# EAGLE design ADC (EAGLE 9.3.1)
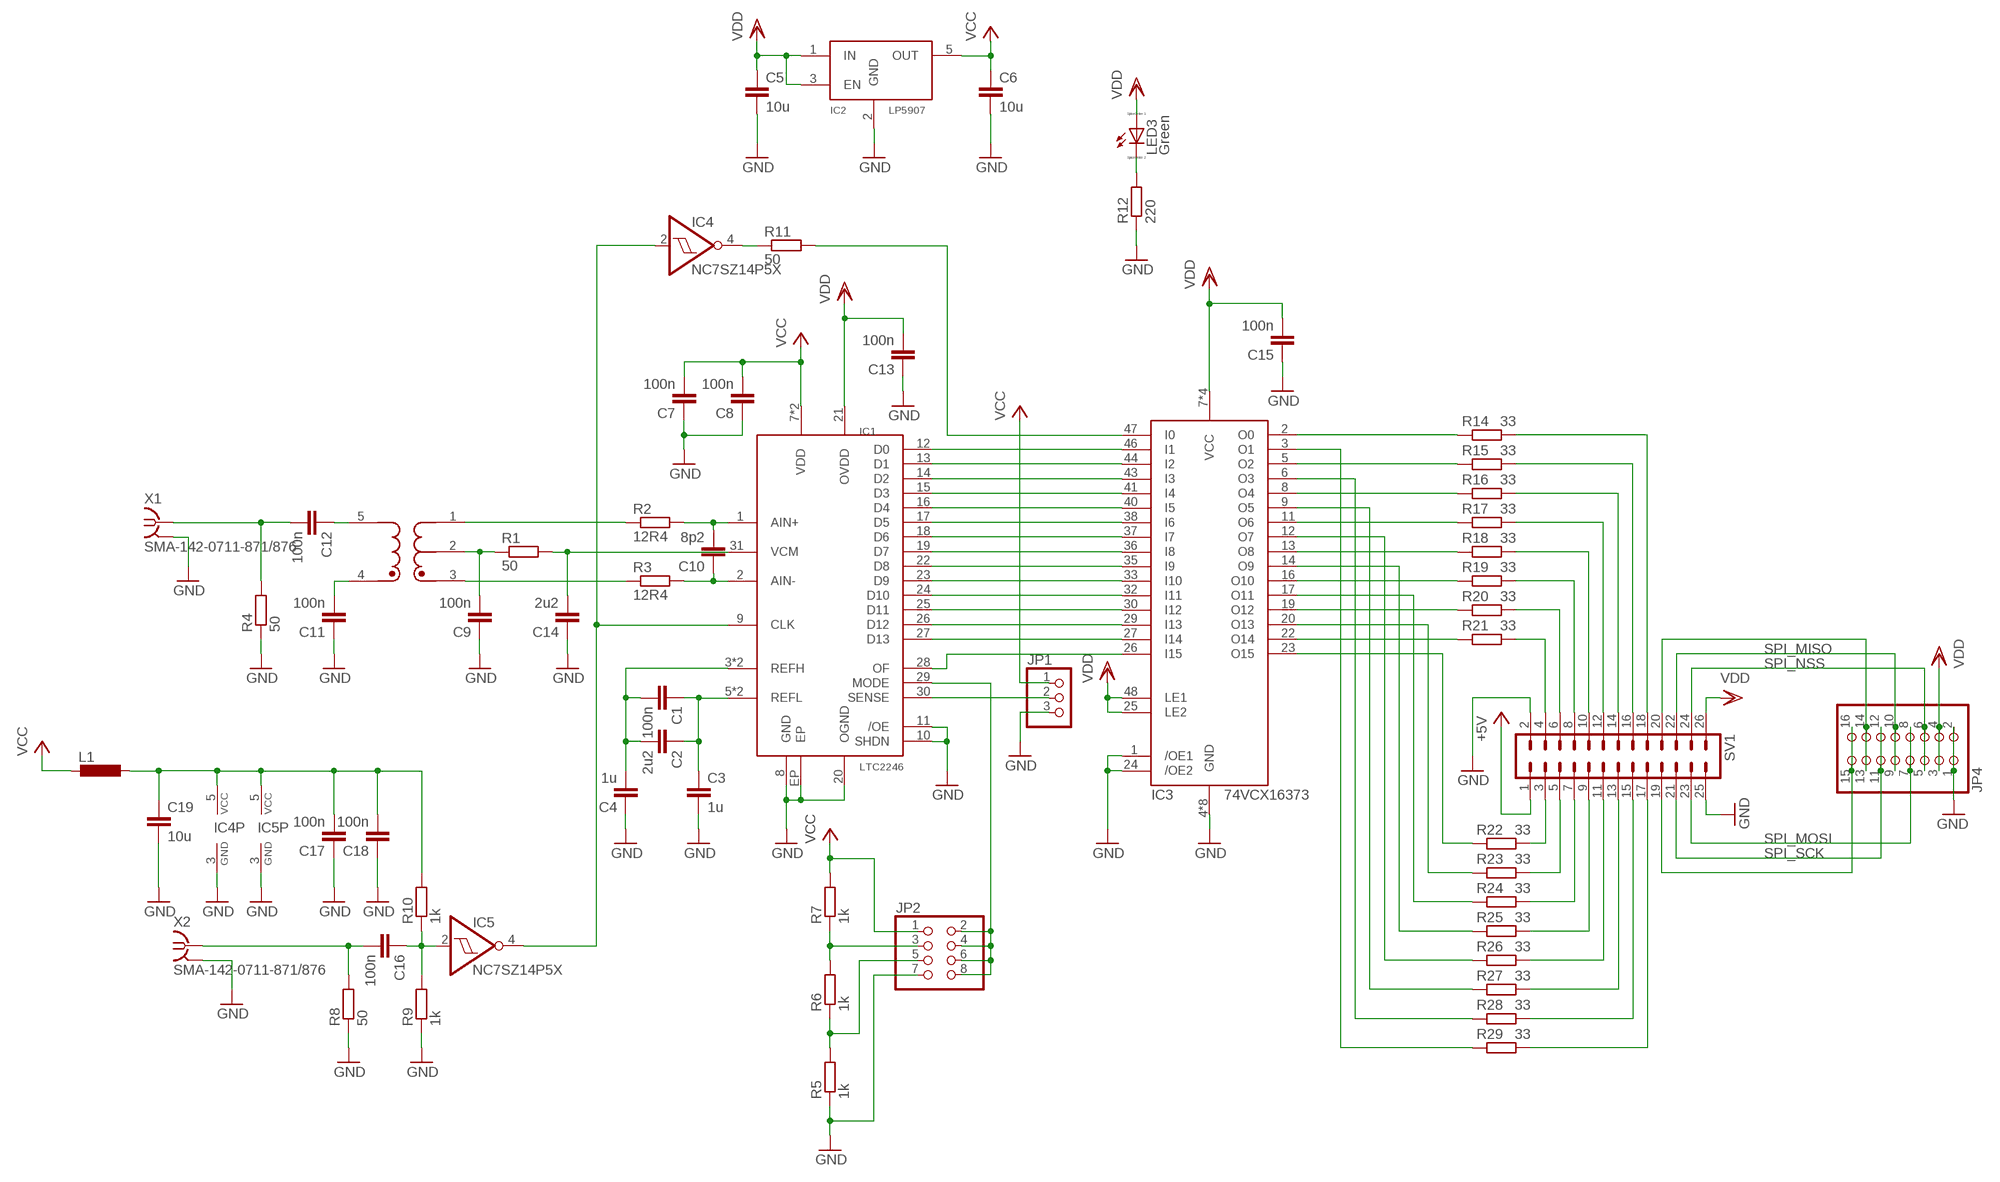
[diagram p0: schematic, sheet 1]

## Parts
B1  ETC1-1T  [SM-22]
C1  100n  C-EUC0402K  [C0402K]
C2  2u2  C-EUC0603K  [C0603K]
C3  1u  C-EUC0603K  [C0603K]
C4  1u  C-EUC0603K  [C0603K]
C5  10u  C-EUC1206K  [C1206K]
C6  10u  C-EUC1206K  [C1206K]
C7  100n  C-EUC0603K  [C0603K]
C8  100n  C-EUC0603K  [C0603K]
C9  100n  C-EUC0603K  [C0603K]
C10  8p2  C-EUC0603K  [C0603K]
C11  100n  C-EUC0603K  [C0603K]
C12  100n  C-EUC0603K  [C0603K]
C13  100n  C-EUC0402K  [C0402K]
C14  2u2  C-EUC0603K  [C0603K]
C15  100n  C-EUC0603K  [C0603K]
C16  100n  C-EUC0603K  [C0603K]
C17  100n  C-EUC0603K  [C0603K]
C18  100n  C-EUC0603K  [C0603K]
C19  10u  C-EUC1206K  [C1206K]
IC1  LTC2246  [TQFP32-EP]
IC2  LP5907  [SOT23-5L]
IC3  74VCX16373  [SOP50P810X120-48]
IC4  NC7SZ14P5X  [SC70-5]
IC5  NC7SZ14P5X  [SC70-5]
JP1  PINHD-1X3  [1X03]
JP2  PINHD-2X4  [2X04]
JP4  PINHD-2X8/90  [2X08/90]
L1  L-EUL2012C  [L2012C]
LED3  Green  LED_ESML0603  [LED_SML0603]
R1  50  R-EU_R0603  [R0603]
R2  12R4  R-EU_R0603  [R0603]
R3  12R4  R-EU_R0603  [R0603]
R4  50  R-EU_R0603  [R0603]
R5  1k  R-EU_R0603  [R0603]
R6  1k  R-EU_R0603  [R0603]
R7  1k  R-EU_R0603  [R0603]
R8  50  R-EU_R0603  [R0603]
R9  1k  R-EU_R0603  [R0603]
R10  1k  R-EU_R0603  [R0603]
R11  50  R-EU_R0603  [R0603]
R12  220  R-EU_R0603  [R0603]
R14  33  R-EU_R0603  [R0603]
R15  33  R-EU_R0603  [R0603]
R16  33  R-EU_R0603  [R0603]
R17  33  R-EU_R0603  [R0603]
R18  33  R-EU_R0603  [R0603]
R19  33  R-EU_R0603  [R0603]
R20  33  R-EU_R0603  [R0603]
R21  33  R-EU_R0603  [R0603]
R22  33  R-EU_R0603  [R0603]
R23  33  R-EU_R0603  [R0603]
R24  33  R-EU_R0603  [R0603]
R25  33  R-EU_R0603  [R0603]
R26  33  R-EU_R0603  [R0603]
R27  33  R-EU_R0603  [R0603]
R28  33  R-EU_R0603  [R0603]
R29  33  R-EU_R0603  [R0603]
SV1  ML26L  [ML26L]
X1  SMA-142-0711-871/876  [J502-ND-142-0711-871/876]
X2  SMA-142-0711-871/876  [J502-ND-142-0711-871/876]

## Nets
+5V: SV1.1
GND: C3.2 C4.1 C5.2 C6.2 C7.1 C8.1 C9.1 C11.1 C13.1 C14.1 C15.1 C17.1 C18.1 C19.2 IC1.8(GND) IC1.10(SHDN) IC1.11(/OE) IC1.20(OGND) IC1.EP IC2.2(GND) IC3.1(/OE1) IC3.4(GND) IC3.10(GND) IC3.15(GND) IC3.21(GND) IC3.24(/OE2) IC3.28(GND) IC3.34(GND) IC3.39(GND) IC3.45(GND) IC4.3(GND) IC5.3(GND) JP1.3 JP2.7 JP4.1 JP4.2 R4.1 R5.1 R8.1 R9.1 R12.1 SV1.2 SV1.25 X1.G@1 X1.G@2 X1.G@3 X1.G@4 X2.G@1 X2.G@2 X2.G@3 X2.G@4
N$1: C1.1 C2.1 C3.1 IC1.5(REFL) IC1.6(REFL)
N$2: C1.2 C2.2 C4.2 IC1.3(REFH) IC1.4(REFH)
N$3: B1.2(SEC_CT) C9.2 R1.1
N$4: C14.2 IC1.31(VCM) R1.2
N$5: C10.2 IC1.1(AIN+) R2.2
N$6: B1.5(PRI) C12.1
N$7: C10.1 IC1.2(AIN-) R3.2
N$8: B1.3(SEC_DOT) R3.1
N$9: B1.4(PRI_DOT) C11.2
N$10: B1.1(SEC) R2.1
N$11: C12.2 R4.2 X1.1
N$12: IC1.12(D0) IC3.46(I1)
N$13: IC1.13(D1) IC3.44(I2)
N$14: IC1.14(D2) IC3.43(I3)
N$15: IC1.15(D3) IC3.41(I4)
N$16: IC1.16(D4) IC3.40(I5)
N$17: IC1.17(D5) IC3.38(I6)
N$18: IC1.18(D6) IC3.37(I7)
N$19: IC1.19(D7) IC3.36(I8)
N$20: IC1.22(D8) IC3.35(I9)
N$21: IC1.23(D9) IC3.33(I10)
N$22: IC1.24(D10) IC3.32(I11)
N$23: IC1.25(D11) IC3.30(I12)
N$24: IC1.26(D12) IC3.29(I13)
N$25: IC1.27(D13) IC3.27(I14)
N$26: IC1.28(OF) IC3.26(I15)
N$27: R18.2 SV1.10
N$28: IC3.23(O15) R22.1
N$29: IC3.22(O14) R21.1
N$30: IC3.20(O13) R23.1
N$31: IC3.19(O12) R20.1
N$32: IC3.17(O11) R24.1
N$33: R19.2 SV1.8
N$34: IC3.14(O9) R25.1
N$35: IC3.12(O7) R26.1
N$36: R17.2 SV1.12
N$37: IC3.9(O5) R27.1
N$38: R16.2 SV1.14
N$39: IC3.6(O3) R28.1
N$40: R15.2 SV1.16
N$41: IC3.3(O1) R29.1
N$42: R14.2 SV1.18
N$43: IC1.30(SENSE) JP1.2
N$44: JP2.5 R5.2 R6.1
N$45: JP2.3 R6.2 R7.1
N$46: IC1.29(MODE) JP2.2 JP2.4 JP2.6 JP2.8
N$47: C16.1 IC5.2(I) R9.2 R10.1
N$48: C16.2 R8.2 X2.1
N$49: IC1.9(CLK) IC4.2(I) IC5.4(O)
N$50: IC4.4(O) R11.1
N$51: IC3.47(I0) R11.2
N$52: LED3.C R12.2
N$53: IC3.2(O0) R14.1
N$54: IC3.5(O2) R15.1
N$55: IC3.8(O4) R16.1
N$56: IC3.11(O6) R17.1
N$57: IC3.13(O8) R18.1
N$58: IC3.16(O10) R19.1
N$59: R20.2 SV1.6
N$60: R21.2 SV1.4
N$61: R22.2 SV1.3
N$62: R23.2 SV1.5
N$63: R24.2 SV1.7
N$64: R25.2 SV1.9
N$65: R26.2 SV1.11
N$66: R27.2 SV1.13
N$67: R28.2 SV1.15
N$68: R29.2 SV1.17
N$73: JP4.13 JP4.14 SV1.20
N$74: JP4.15 JP4.16 SV1.19
SPI_MISO: JP4.9 JP4.10 SV1.22
SPI_MOSI: JP4.7 JP4.8 SV1.23
SPI_NSS: JP4.5 JP4.6 SV1.24
SPI_SCK: JP4.11 JP4.12 SV1.21
VCC: C6.1 C7.2 C8.2 IC1.7(VDD) IC1.32(VDD) IC2.5(OUT) JP1.1 JP2.1 L1.2 R7.2
VCC1: C17.2 C18.2 C19.1 IC4.5(VCC) IC5.5(VCC) L1.1 R10.2
VDD: C5.1 C13.2 C15.2 IC1.21(OVDD) IC2.1(IN) IC2.3(EN) IC3.7(VCC) IC3.18(VCC) IC3.25(LE2) IC3.31(VCC) IC3.42(VCC) IC3.48(LE1) JP4.3 JP4.4 LED3.A SV1.26

## Library data of the parts
B1 = transformers:ETC1-1T
C1-C4 C7-C18 = rcl:C-EU: CAPACITOR, European symbol; SPICEPREFIX: C
C5 C6 C19 = resistor:C-EU: CAPACITOR, European symbol
IC1 = custom-ic:LTC2246
IC2 = custom-ic:LP5907
IC3 = custom-ic:74VCX16373
IC4 IC5 = 74xx-little-de:NC7SZ14: TinyLogic(R) UHS Inverter with Schmitt Trigger Input Source: http://www.fairchildsemi.com/ds/NC/NC7SZ14.pdf
JP1 = pinhead:PINHD-1X3: PIN HEADER
JP2 = pinhead:PINHD-2X4: PIN HEADER
JP4 = pinhead:PINHD-2X8: PIN HEADER
L1 = rcl:L-EU: INDUCTOR, European symbol
LED3 = eagle-ltspice:LED_E: LED Source: http://www.osram.convergy.de Source: www.luxeon.com Source: www.kingbright.com; SPICEMODEL: NONE; SPICEPREFIX: D; SPICETYPE: diode
R1-R12 R14-R29 = resistor:R-EU_: RESISTOR, European symbol
SV1 = con-ml:ML26L: HARTING; OC_FARNELL: unknown; OC_NEWARK: unknown
X1 X2 = con-coax:SMA-: SMA 50 Ohm End Launch Jack Receptacle - Round Contact Johnson Components Source: www.johnsoncomponents.com .. J502-ND.pdf; MF: JOHNSON COMPONENTS; MPN: 142-0711-871; OC_FARNELL: unknown; OC_NEWARK: 01C1639

## Board
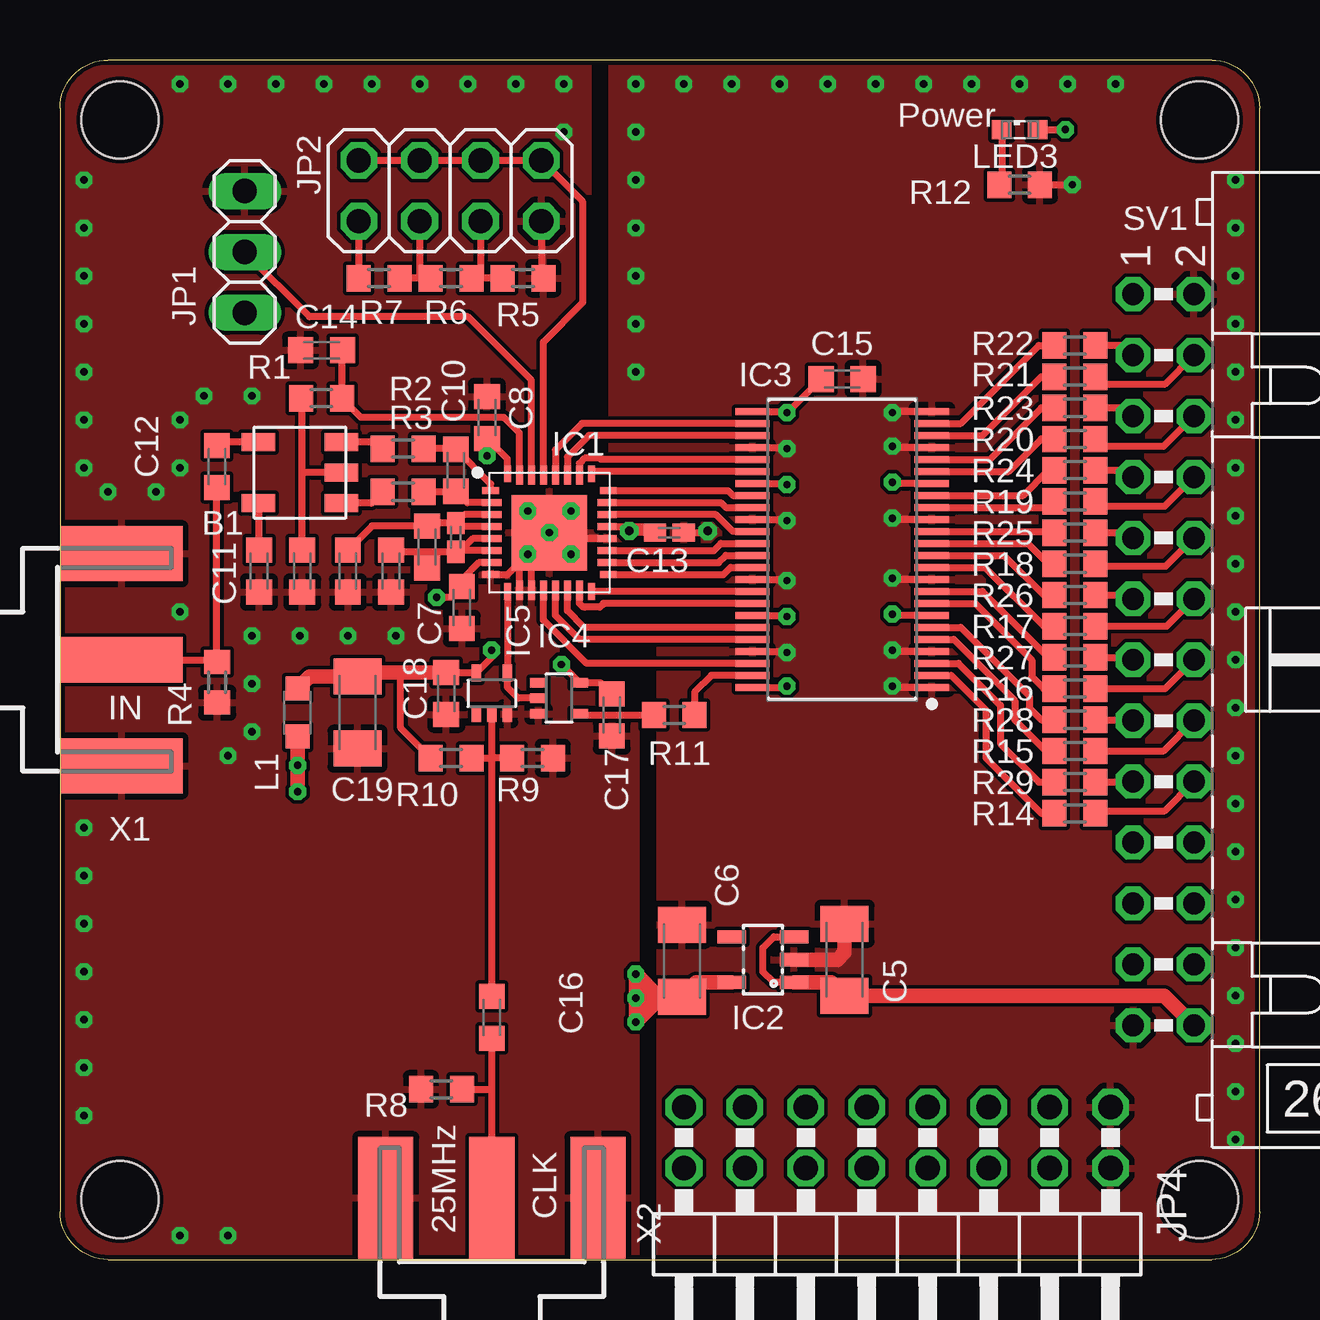
[diagram p1: board, top side]
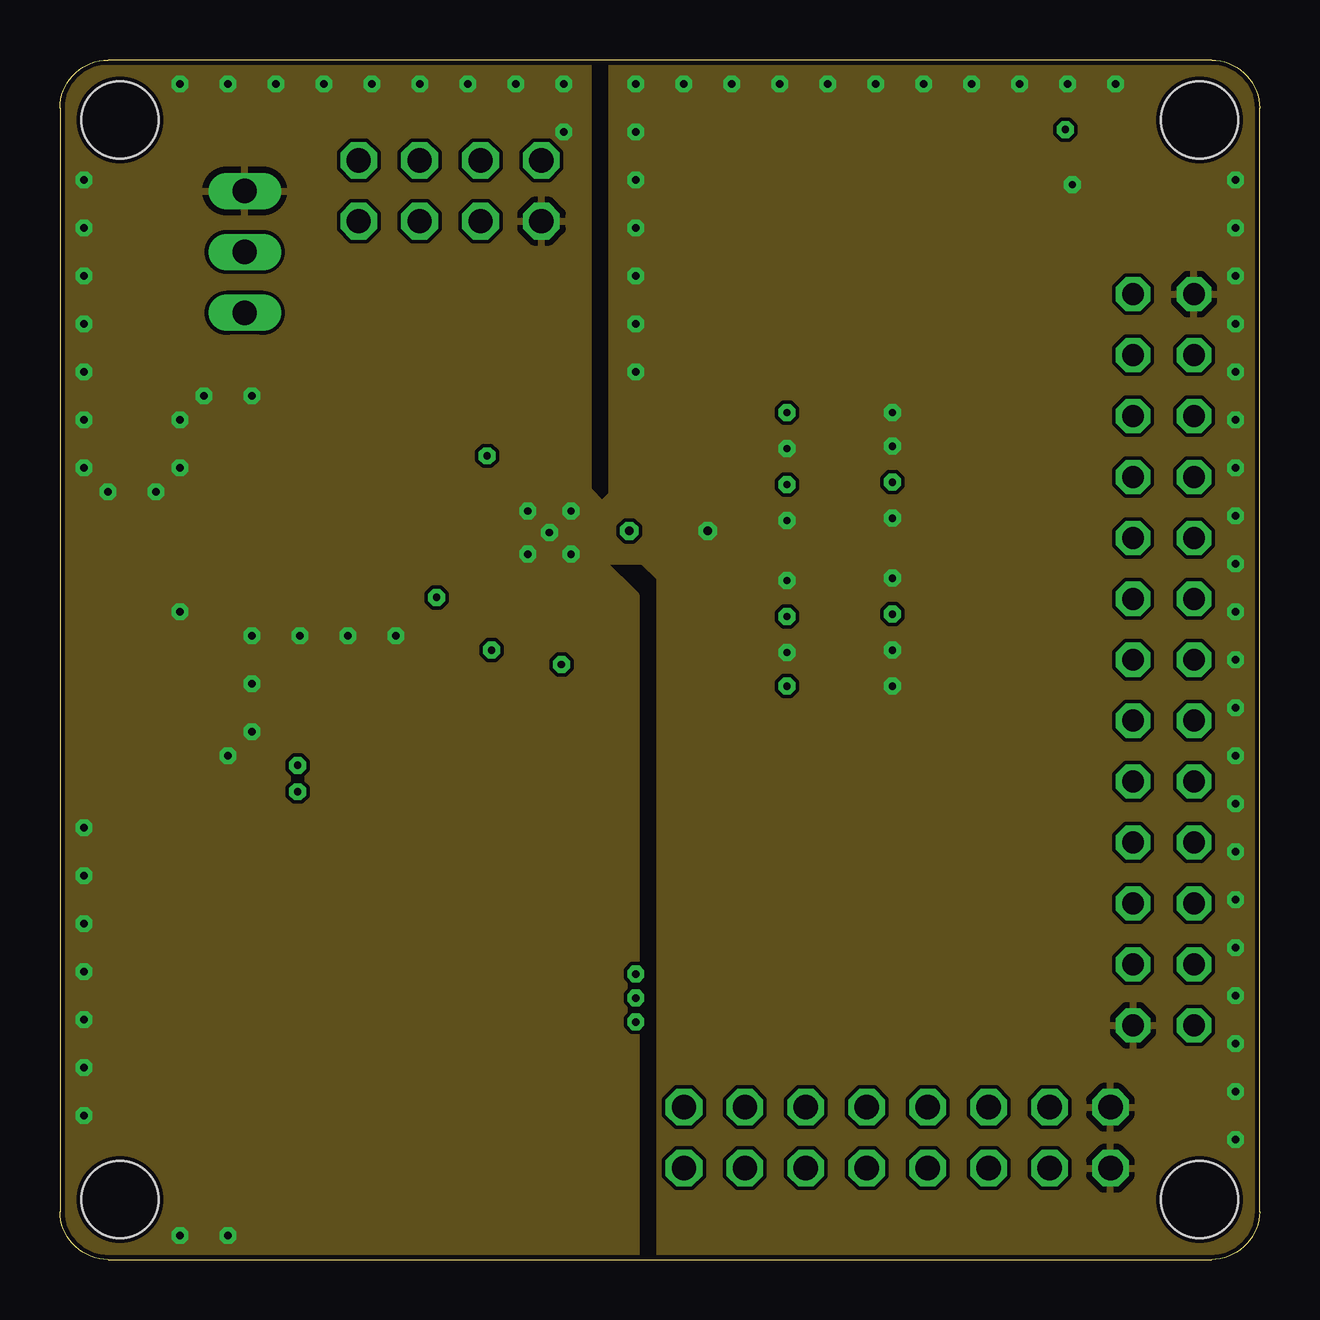
[diagram p2: board, inner layer Route2]
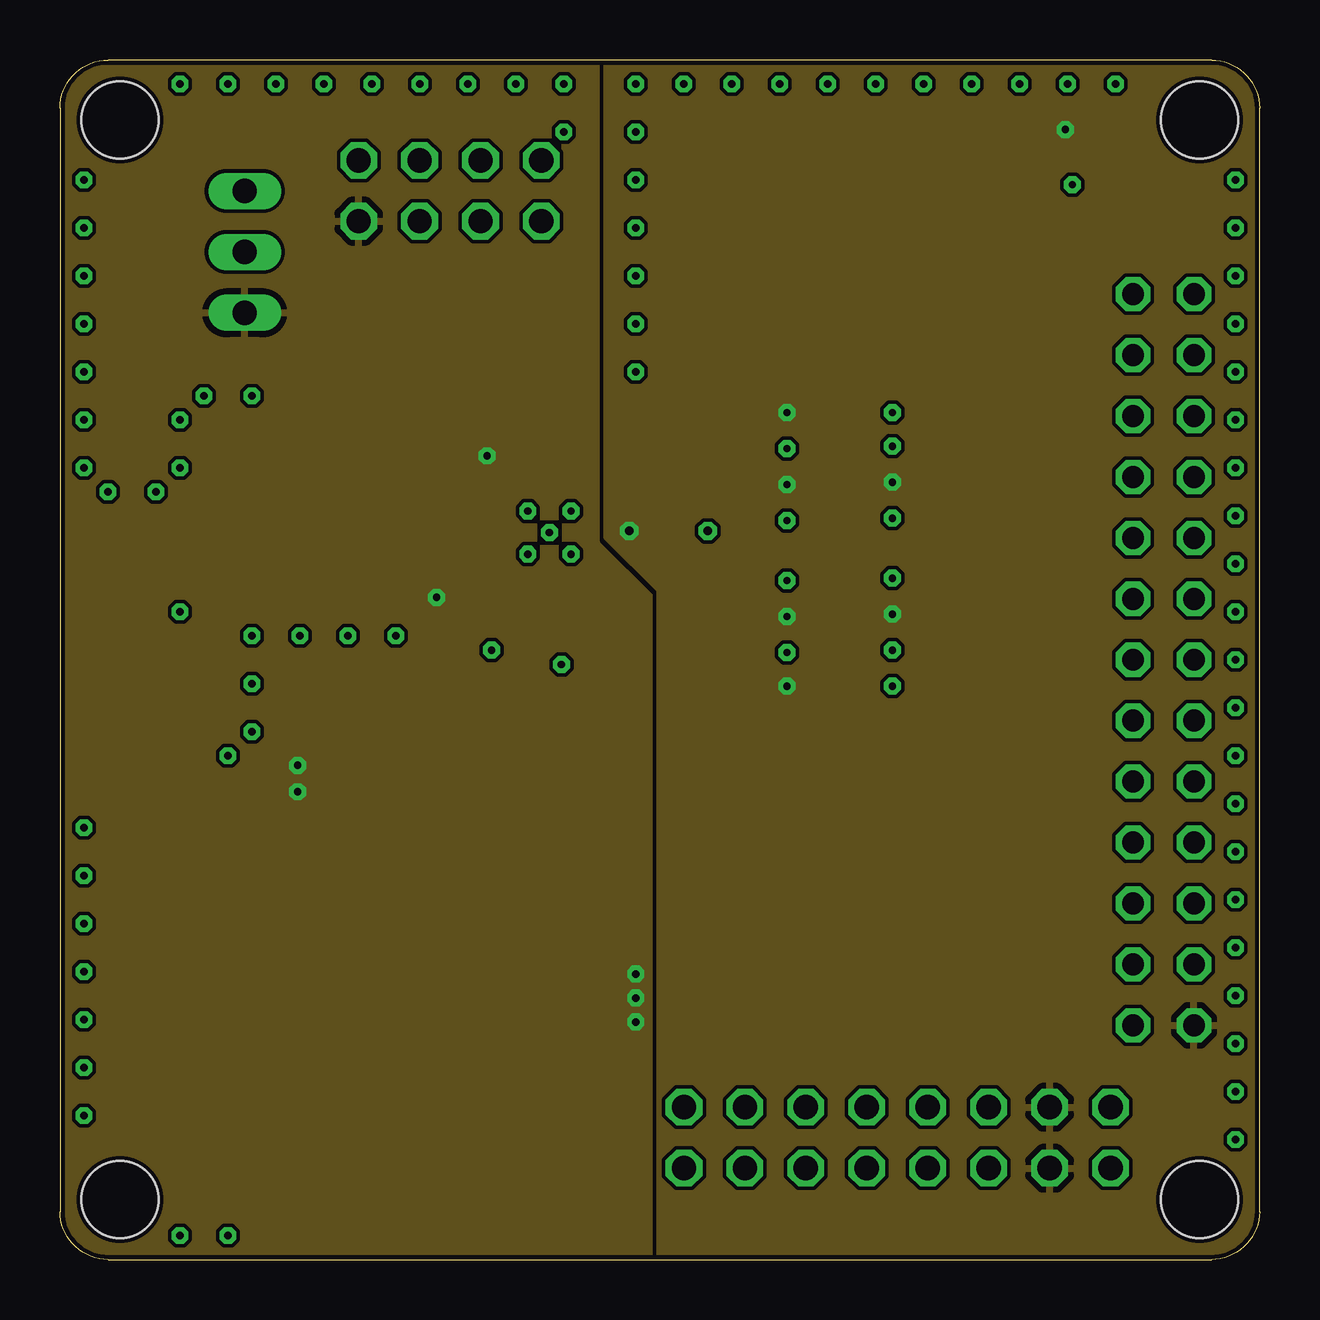
[diagram p3: board, inner layer Route15]
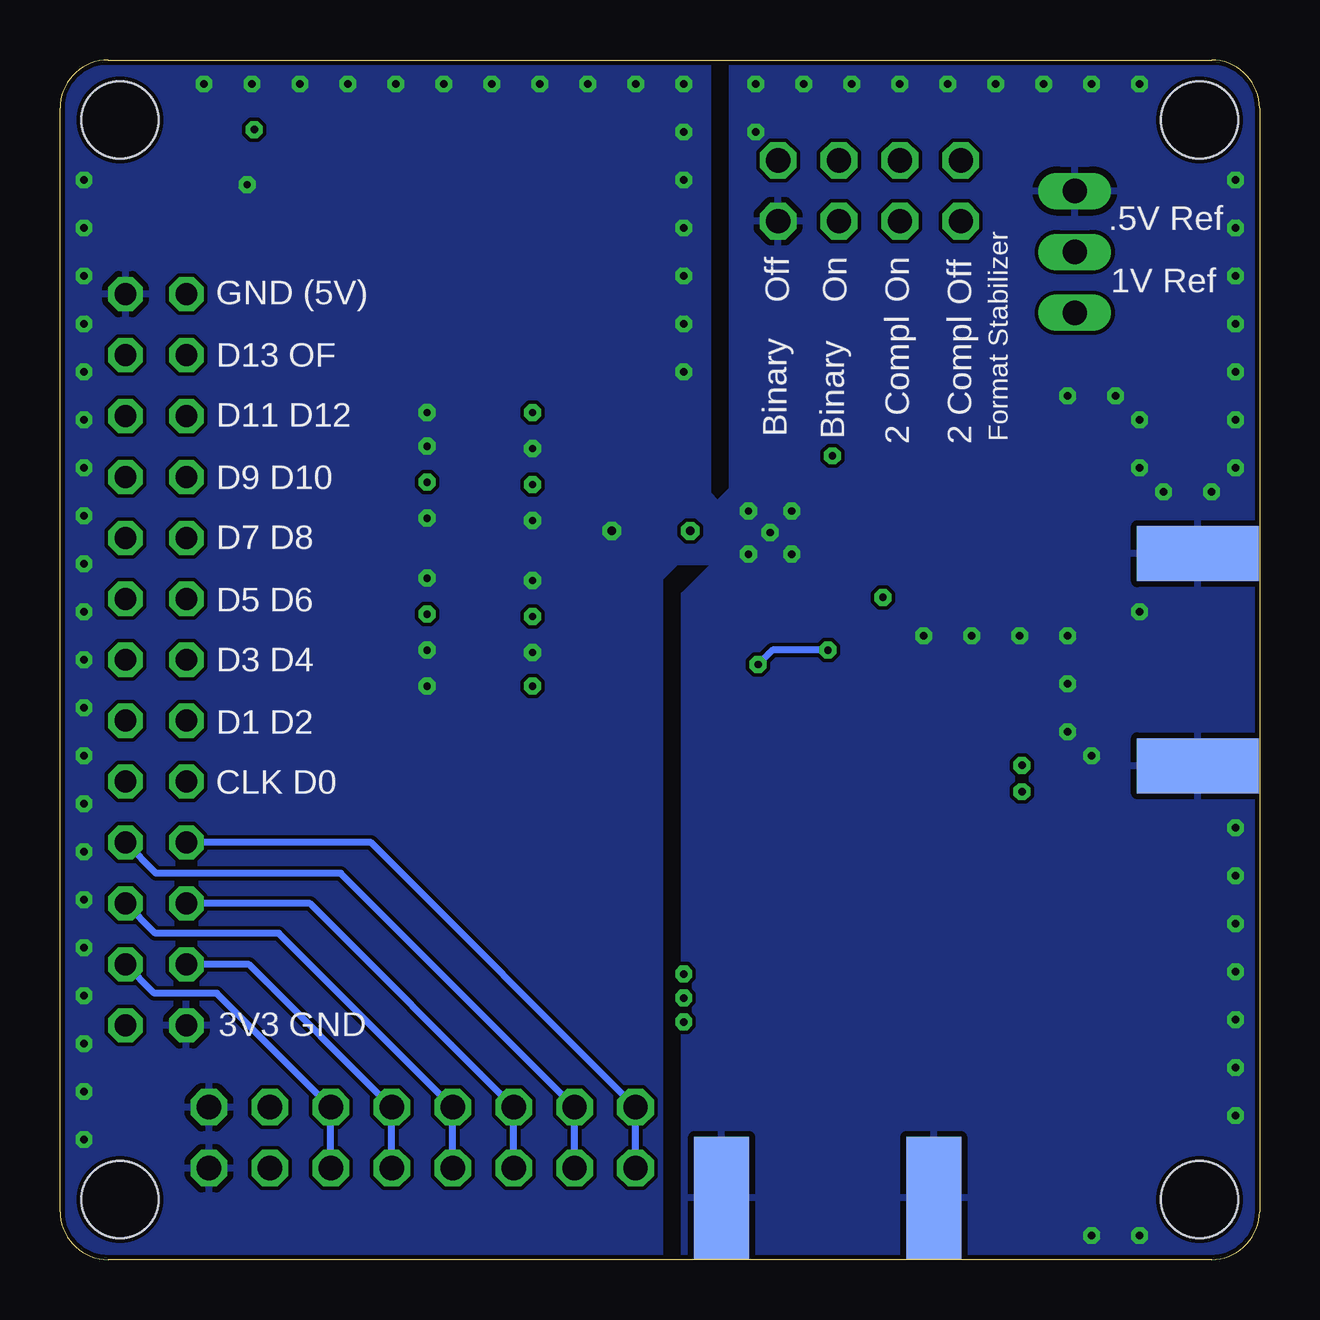
[diagram p4: board, bottom side, seen from below]

Size 50 x 50 mm. Coordinates in mm from the lower left corner, seen from the top.
Outline: 0,48 0,2 arc90 2,0 48,0 arc90 50,2 50,48 arc90 48,50 2,50 arc90 0,48
Copper layers (1+2*15+16): Top 0.035mm / dielectric 0.2mm / Route2 0.0175mm / dielectric 1.064mm / Route15 0.0175mm / dielectric 0.2mm / Bottom 0.035mm
Design rules "JLCPCB4L_7628": minimum track width 6mil, minimum drill 0.3mm, track to track 6mil, track to pad 6mil, pad to pad 6mil, via to via 6mil, smd to smd 6mil, copper to edge 0.2mm, drill to drill 0.2mm, minimum pad ring 10mil, minimum via ring 8mil, stop-mask expansion 4mil, vias tented up to drill 0mil, thermal gap 10mil
Holes 3.2 mm at 2.5,47.5 47.5,47.5 47.5,2.5 2.5,2.5

### Footprints (pad centres in the part's own frame; a part is rotated, then mirrored left to right if it is on the bottom)
SM-22 = smd 0.762 x 1.397: 1 -1.27,1.727; 2 0,1.727; 3 1.27,1.727; 4 1.27,-1.727; 5 -1.27,-1.727
C0402K = smd 0.925 x 0.74: 1 -0.6,0; 2 0.6,0
C0603K = smd 1.05 x 1.08: 1 -0.875,0; 2 0.875,0
C1206K = smd 1.5 x 2: 1 -1.5,0; 2 1.5,0
TQFP32-EP = smd 0.7 x 0.3: 1 -2.45,1.75; 8 -2.45,-1.75; 17 2.45,-1.75; 24 2.45,1.75 | smd 0.8 x 0.3: 2 -2.4,1.25; 3 -2.4,0.75; 4 -2.4,0.25; 5 -2.4,-0.25; 6 -2.4,-0.75; 7 -2.4,-1.25; 18 2.4,-1.25; 19 2.4,-0.75; 20 2.4,-0.25; 21 2.4,0.25; 22 2.4,0.75; 23 2.4,1.25 | smd 0.3 x 0.7: 9 -1.75,-2.45; 16 1.75,-2.45; 25 1.75,2.45; 32 -1.75,2.45 | smd 0.3 x 0.8: 10 -1.25,-2.4; 11 -0.75,-2.4; 12 -0.25,-2.4; 13 0.25,-2.4; 14 0.75,-2.4; 15 1.25,-2.4; 26 1.25,2.4; 27 0.75,2.4; 28 0.25,2.4; 29 -0.25,2.4; 30 -0.75,2.4; 31 -1.25,2.4 | smd 3.15 x 3.15: EP 0,0
SOT23-5L = smd 0.55 x 1.2: 1 -0.95,-1.3; 2 0,-1.3; 3 0.95,-1.3; 4 0.95,1.3; 5 -0.95,1.3
SOP50P810X120-48 = smd 1.43 x 0.3: 1 -3.737,5.75; 2 -3.737,5.25; 3 -3.737,4.75; 4 -3.737,4.25; 5 -3.737,3.75; 6 -3.737,3.25; 7 -3.737,2.75; 8 -3.737,2.25; 9 -3.737,1.75; 10 -3.737,1.25; 11 -3.737,0.75; 12 -3.737,0.25; 13 -3.737,-0.25; 14 -3.737,-0.75; 15 -3.737,-1.25; 16 -3.737,-1.75; 17 -3.737,-2.25; 18 -3.737,-2.75; 19 -3.737,-3.25; 20 -3.737,-3.75; 21 -3.737,-4.25; 22 -3.737,-4.75; 23 -3.737,-5.25; 24 -3.737,-5.75; 25 3.737,-5.75; 26 3.737,-5.25; 27 3.737,-4.75; 28 3.737,-4.25; 29 3.737,-3.75; 30 3.737,-3.25; 31 3.737,-2.75; 32 3.737,-2.25; 33 3.737,-1.75; 34 3.737,-1.25; 35 3.737,-0.75; 36 3.737,-0.25; 37 3.737,0.25; 38 3.737,0.75; 39 3.737,1.25; 40 3.737,1.75; 41 3.737,2.25; 42 3.737,2.75; 43 3.737,3.25; 44 3.737,3.75; 45 3.737,4.25; 46 3.737,4.75; 47 3.737,5.25; 48 3.737,5.75
SC70-5 = smd 0.4 x 0.7: 1 -0.65,-0.85; 2 0,-0.85; 3 0.65,-0.85; 4 0.65,0.85; 5 -0.65,0.85
1X03 = drill 1.016 long: 1 -2.54,0; 2 0,0; 3 2.54,0
2X04 = drill 1.016 octagon: 1 -3.81,-1.27; 2 -3.81,1.27; 3 -1.27,-1.27; 4 -1.27,1.27; 5 1.27,-1.27; 6 1.27,1.27; 7 3.81,-1.27; 8 3.81,1.27
2X08/90 = drill 1.016 octagon: 1 -8.89,-6.35; 2 -8.89,-3.81; 3 -6.35,-6.35; 4 -6.35,-3.81; 5 -3.81,-6.35; 6 -3.81,-3.81; 7 -1.27,-6.35; 8 -1.27,-3.81; 9 1.27,-6.35; 10 1.27,-3.81; 11 3.81,-6.35; 12 3.81,-3.81; 13 6.35,-6.35; 14 6.35,-3.81; 15 8.89,-6.35; 16 8.89,-3.81
L2012C = smd 1 x 1: 1 -1,0; 2 1,0
LED_SML0603 = smd 0.8 x 0.8: A 0.75,0; C -0.75,0
R0603 = smd 1 x 1.1: 1 -0.85,0; 2 0.85,0
ML26L = drill 0.914 octagon: 1 -15.24,-1.27; 2 -15.24,1.27; 3 -12.7,-1.27; 4 -12.7,1.27; 5 -10.16,-1.27; 6 -10.16,1.27; 7 -7.62,-1.27; 8 -7.62,1.27; 9 -5.08,-1.27; 10 -5.08,1.27; 11 -2.54,-1.27; 12 -2.54,1.27; 13 0,-1.27; 14 0,1.27; 15 2.54,-1.27; 16 2.54,1.27; 17 5.08,-1.27; 18 5.08,1.27; 19 7.62,-1.27; 20 7.62,1.27; 21 10.16,-1.27; 22 10.16,1.27; 23 12.7,-1.27; 24 12.7,1.27; 25 15.24,-1.27; 26 15.24,1.27
J502-ND-142-0711-871/876 = smd 5.08 x 1.905: 1 2.565,0 | smd 5.08 x 2.286: G@1 2.565,4.42; G@2 2.565,-4.42 | smd 5.08 x 2.286 bottom: G@3 2.565,4.42; G@4 2.565,-4.42

### Placement (x,y rotation side)
B1  10,32.8 270 top
C1  16.5,30.1 90 top
C2  15.3,29.7 90 top
C3  13.8,28.7 270 top
C4  12,28.7 90 top
C5  32.7,12.5 90 top
C6  25.92,12.45 90 top
C7  16.75,27.18 90 top
C8  17.8,35.1 270 top
C9  10.1,28.7 90 top
C10  16.5,32.9 90 top
C11  8.3,28.7 90 top
C12  6.54,33.05 270 top
C13  25.4,30.3 180 top
C14  10.9,37.9 0 top
C15  32.6,36.7 180 top
C16  18,10.1 270 top
C17  23,22.7 90 top
C18  16.1,23.6 90 top
C19  12.4,22.8 270 top
IC1  20.4,30.3 0 top
IC2  29.3,12.5 90 top
IC3  32.6,29.6 180 top
IC4  20.8,23.4 270 top
IC5  18,23.6 0 top
JP1  7.7,42 90 top
JP2  16.26,44.55 0 top
JP4  34.9,0 180 top
L1  9.9,22.8 270 top
LED3  40,47.1 0 top
R1  10.9,35.9 0 top
R2  14.3,33.8 0 top
R3  14.3,32 0 top
R4  6.55,24.06 90 top
R5  19.3,40.9 180 top
R6  16.3,40.9 180 top
R7  13.3,40.9 180 top
R8  15.9,7.1 0 top
R9  19.7,20.9 180 top
R10  16.3,20.9 180 top
R11  25.6,22.7 0 top
R12  40,44.8 180 top
R14  42.3,18.6 0 top
R15  42.3,21.2 0 top
R16  42.3,23.8 0 top
R17  42.3,26.4 0 top
R18  42.3,29 0 top
R19  42.3,31.6 0 top
R20  42.3,34.2 0 top
R21  42.3,36.8 0 top
R22  42.3,38.1 0 top
R23  42.3,35.5 0 top
R24  42.3,32.9 0 top
R25  42.3,30.3 0 top
R26  42.3,27.7 0 top
R27  42.3,25.1 0 top
R28  42.3,22.5 0 top
R29  42.3,19.9 0 top
SV1  46,25 270 top
X1  0,25 0 top
X2  18,0 90 top

### Tracks (layer width: path | path; a pad name or v marks a point on that pad's centre or on a via)
GND  (via drill 0.3, 0.35)
  Top 0.3: C13.1 26.93,30.3 v27,30.37 | IC1.11 19.65,29.55 | 19.65,29.55 IC1.EP | IC1.10 19.15,29.05 19.65,29.55 | IC1.8 18.65,28.55 IC1.EP | IC1.20 21.45,30.05 21.1,30.4 21,30.3 IC1.EP | JP2.7 20.07,40.98 R5.1 | IC3.28 30.25,33.85 v30.3,33.8 | IC3.34 30.25,30.85 v30.3,30.8 | IC3.39 30.25,28.35 v30.3,28.3 | IC3.45 30.25,25.35 v30.3,25.3 | IC3.1 34.75,23.85 v34.7,23.9 | IC3.4 34.75,25.35 v34.7,25.4 | IC3.10 34.75,28.35 v34.7,28.4 | IC3.15 34.75,30.85 v34.7,30.9 | IC3.21 34.75,33.85 v34.7,33.9 | IC3.24 34.75,35.35 v34.7,35.3 | R12.1 v42.2,44.8
  Top 0.6: IC2.2 32.4,12.5 32.7,12.8 C5.2
  other vias: 20.4,30.3 21.3,31.2 21.3,29.4 19.5,29.4 19.5,31.2 24,49 26,49 28,49 30,49 32,49 34,49 36,49 38,49 40,49 42,49 44,49 49,45 49,43 49,41 49,39 49,37 49,35 49,33 49,31 49,29 49,27 49,25 49,23 49,21 49,19 49,17 49,15 49,13 49,11 49,9 49,7 49,5 24,47 24,45 24,43 24,41 24,39 24,37 21,49 21,47 19,49 17,49 15,49 13,49 11,49 9,49 7,49 5,49 1,45 1,43 1,41 1,39 1,37 1,35 1,33 2,32 4,32 5,33 5,35 6,36 8,36 5,27 8,26 8,24 8,22 7,21 10,26 12,26 14,26 1,18 1,16 1,14 1,12 1,10 1,8 1,6 5,1 7,1
  pour Route2: -2.4,53.7 18.3,53.7 22,50 22,32.1 22.6,31.5 23,31.9 23,50.9 25.6,53.5 48.3,53.5 54.1,47.7 54.1,0.7 49.9,-3.5 25,-3.5 25,28.4 24.3,29.1 22.6,29.1 24,27.7 24,-3.7 0.9,-3.7 -4.1,1.3 -4.1,52
  pour Top: -2.4,53.7 18.3,53.7 22,50 22,32.1 22.6,31.5 23,31.9 23,50.9 25.6,53.5 48.3,53.5 54.1,47.7 54.1,0.7 49.9,-3.5 25,-3.5 25,28.4 24.3,29.1 22.6,29.1 24,27.7 24,-3.7 0.9,-3.7 -4.1,1.3 -4.1,52
  pour Bottom: -2.4,53.7 18.3,53.7 22,50 22,32.1 22.6,31.5 23,31.9 23,50.9 25.6,53.5 48.3,53.5 54.1,47.7 54.1,0.7 49.9,-3.5 25,-3.5 25,28.4 24.3,29.1 22.6,29.1 24,27.7 24,-3.7 0.9,-3.7 -4.1,1.3 -4.1,52
N$1
  Top 0.3: IC1.6 16.7,29.55 | 16.7,29.55 16.55,29.55 C1.1 15.3,29.5 | IC1.5 17.2,30.05 16.7,29.55 | 15.3,29.5 13.88,29.5 C3.1 | C2.1 15.3,29.5
N$2
  Top 0.3: IC1.4 16.65,30.55 C1.2 | IC1.3 16.85,31.05 C1.2 | C1.2 15.43,30.7 C2.2 13,30.57 C4.2
N$3
  Top 0.3: C9.2 10.1,32.8 | 10.1,32.8 10.1,35.85 R1.1 | B1.2 10.1,32.8
N$4
  Top 0.3: IC1.31 19.15,34.45 18.5,35.1 12.55,35.1 R1.2 11.75,37.88 C14.2
N$5
  Top 0.3: IC1.1 17.95,32.33 C10.2 16.48,33.8 R2.2
N$6
  Top 0.3: B1.5 6.68,34.07 C12.1
N$7
  Top 0.3: IC1.2 16.98,31.55 C10.1 16.48,32 R3.2
N$8
  Top 0.3: R3.1 12.98,31.53 B1.3
N$9
  Top 0.3: B1.4 8.27,29.6 C11.2
N$10
  Top 0.3: R2.1 13.18,34.07 B1.1
N$11
  Top 0.3: X1.1 6.54,25 | 6.54,25 C12.2 | R4.2 6.55,24.99 6.54,25
N$12
  Top 0.3: IC3.46 21.95,24.85 20.15,26.65 IC1.12
N$13
  Top 0.3: IC3.44 21.65,25.85 20.65,26.85 IC1.13
N$14
  Top 0.3: IC3.43 21.85,26.35 21.15,27.05 IC1.14
N$15
  Top 0.3: IC3.41 22.65,27.35 22.5,27.2 21.88,27.2 21.87,27.2 21.8,27.2 21.65,27.35 IC1.15
N$16
  Top 0.3: IC3.40 IC1.16
N$17
  Top 0.3: IC1.17 27.65,28.55 27.95,28.85 IC3.38
N$18
  Top 0.3: IC1.18 27.45,29.05 27.75,29.35 IC3.37
N$19
  Top 0.3: IC1.19 27.25,29.55 27.55,29.85 IC3.36
N$20
  Top 0.3: IC3.35 28.05,30.35 27.35,31.05 IC1.22
N$21
  Top 0.3: IC1.23 27.55,31.55 27.75,31.35 IC3.33
N$22
  Top 0.3: IC1.24 27.85,32.05 28.05,31.85 IC3.32
N$23
  Top 0.3: IC3.30 22.25,32.85 IC1.25
N$24
  Top 0.3: IC3.29 22.55,33.35 22.5,33.4 21.88,33.4 21.65,33.18 IC1.26
N$25
  Top 0.3: IC3.27 22.05,34.35 21.15,33.45 IC1.27
N$26
  Top 0.3: IC3.26 21.75,34.85 20.65,33.75 IC1.28
N$27
  Top 0.3: R18.2 43.25,28.9 46.09,28.9 SV1.10
N$28
  Top 0.3: IC3.23 37.55,34.85 40.8,38.1 R22.1
N$29
  Top 0.3: IC3.22 38.45,34.35 40.9,36.8 R21.1
N$30
  Top 0.3: IC3.20 38.75,33.35 40.9,35.5 R23.1
N$31
  Top 0.3: IC3.19 39.55,32.85 40.9,34.2 R20.1
N$32
  Top 0.3: IC3.17 40.15,31.85 41.2,32.9 R24.1
N$33
  Top 0.3: R19.2 43.35,31.4 46.05,31.4 SV1.8
N$34
  Top 0.3: IC3.14 41.4,30.35 R25.1
N$35
  Top 0.3: IC3.12 39.35,29.35 41,27.7 R26.1
N$36
  Top 0.3: R17.2 46.13,26.4 SV1.12
N$37
  Top 0.3: IC3.9 38.45,27.85 41.2,25.1 R27.1
N$38
  Top 0.3: R16.2 46.07,23.8 SV1.14
N$39
  Top 0.3: IC3.6 37.55,26.35 40.4,23.5 40.4,23 40.9,22.5 R28.1
N$40
  Top 0.3: R15.2 46.01,21.2 SV1.16
N$41
  Top 0.3: IC3.3 37.45,24.85 39.2,23.1 39.2,21.5 40.8,19.9 R29.1
N$42
  Top 0.3: R14.2 43.25,18.7 46.05,18.7 SV1.18
N$43
  Top 0.3: IC1.30 19.65,36.65 17,39.3 10.4,39.3 JP1.2
N$44
  Top 0.3: R5.2 17.5,40.9 | 17.5,40.9 R6.1 | JP2.5 17.53,40.93 17.5,40.9
N$45
  Top 0.3: R6.2 15,40.9 | 15,40.9 R7.1 | JP2.3 14.99,40.91 15,40.9
N$46
  Top 0.3: JP2.2 JP2.4 JP2.6 JP2.8 21.8,44.09 21.8,39.9 20.15,38.25 IC1.29
N$47
  Top 0.3: C16.1 18,20.9 | 18,20.9 IC5.2 | R9.2 18,20.9 | R10.1 18,20.9
N$48
  Top 0.3: X2.1 18,7.1 | 18,7.1 C16.2 | R8.2 18,7.1
N$49
  Top 0.3: IC1.9 IC5.4 18.65,23.85 19.1,23.4 IC4.2
N$50
  Top 0.3: IC4.4 21.7,22.7 R11.1
N$51
  Top 0.3: IC3.47 27.15,24.35 26.45,23.65 R11.2
N$52
  Top 0.3: LED3.C 39.25,44.9 R12.2
N$53
  Top 0.3: IC3.2 37.15,24.35 38.6,22.9 38.6,20.9 40.9,18.6 R14.1
N$54
  Top 0.3: IC3.5 37.25,25.85 39.8,23.3 39.8,22.5 41.1,21.2 R15.1
N$55
  Top 0.3: IC3.8 38.15,27.35 40.5,25 40.5,24.3 41,23.8 R16.1
N$56
  Top 0.3: IC3.11 38.55,28.85 41,26.4 R17.1
N$57
  Top 0.3: IC3.13 40.35,29.85 41.2,29 R18.1
N$58
  Top 0.3: IC3.16 41.2,31.35 R19.1
N$59
  Top 0.3: R20.2 43.45,33.9 46.01,33.9 SV1.6
N$60
  Top 0.3: R21.2 43.45,36.5 46.07,36.5 SV1.4
N$61
  Top 0.3: SV1.3 44.33,38.1 R22.2
N$62
  Top 0.3: SV1.5 44.39,35.5 R23.2
N$63
  Top 0.3: R24.2 44.45,32.9 SV1.7
N$64
  Top 0.3: R25.2 44.51,30.3 SV1.9
N$65
  Top 0.3: R26.2 44.57,27.7 SV1.11
N$66
  Top 0.3: R27.2 44.63,25.1 SV1.13
N$67
  Top 0.3: R28.2 44.69,22.5 SV1.15
N$68
  Top 0.3: R29.2 44.71,19.9 SV1.17
N$73
  Bottom 0.3: JP4.14 JP4.13 38.3,16.1 45.99,16.1 SV1.20
N$74
  Bottom 0.3: JP4.16 JP4.15 37.04,17.38 SV1.19
SPI_MISO
  Bottom 0.3: JP4.10 JP4.9 40.88,13.6 46.03,13.6 SV1.22
SPI_MOSI
  Bottom 0.3: JP4.8 JP4.7 42.12,12.3 SV1.23
SPI_NSS
  Bottom 0.3: JP4.6 JP4.5 43.46,11.1 46.07,11.1 SV1.24
SPI_SCK
  Bottom 0.3: JP4.12 JP4.11 39.58,14.84 SV1.21
VCC  (via drill 0.3)
  Top 0.3: IC1.7 17.45,29.05 16.75,28.35 C7.2 16.3,27.6 v15.7,27.6 | IC1.32 18.65,33.38 C8.2 v17.8,33.5 | JP2.1 R7.2
  Top 0.6: L1.2 v9.9,20.6 v9.9,19.5 | IC2.5 26.52,11.55 C6.1 25.05,10.95 | 24.95,10.95 24.05,10.95 | 24.05,10.95 24,11 v24,11.9 24.95,10.95 | 24.05,10.95 v24,10.9 v24,9.9 25.05,10.95 | 24.95,10.95 25.05,10.95
  pour Route15 (rank 2): -4.4,53.6 45.6,53.6 45.6,-2.9 -4.4,-2.9
VCC1  (via drill 0.3)
  Top 0.3: C17.2 22.52,24.05 IC4.5 v20.9,24.8 | C18.2 16.12,24.45 IC5.5 17.99,25.09 v17.99,25.4 | R10.2 14.2,22.15 14.2,24.48
  Top 0.6: C18.2 14.2,24.48 12.57,24.48 C19.1 10.4,24.3 L1.1
  Bottom 0.3: v17.99,25.4 20.3,25.4 v20.9,24.8
VDD  (via drill 0.3, 0.35)
  Top 0.3: IC1.21 24.55,30.55 C13.2 23.8,30.3 v23.73,30.37 | IC3.25 30.25,35.35 v30.3,35.3 30.32,35.3 C15.2 | IC3.31 30.25,32.35 v30.3,32.3 | IC3.42 30.25,26.85 v30.3,26.8 | IC3.48 30.25,23.85 v30.3,23.9 | IC3.7 34.75,26.85 v34.7,26.9 | IC3.18 34.75,32.35 v34.7,32.4 | IC2.1 29.75,11.55 29.3,12 29.3,13 29.75,13.45 IC2.3 | LED3.A v41.9,47.1
  Top 0.6: SV1.26 46.03,11 C5.1 32.15,11.55 IC2.1
  pour Route15: 51.2,-1.3 25,-1.3 25,27.9 22.8,30.1 22.8,51.8 51.2,51.7

### Text on the board
tPlace: Power | IN | CLK | 25MHz
bPlace: .5V Ref | 1V Ref | Off | On | On | Off | GND (5V) | D13 OF | D11 D12 | Format Stabilizer | 2 Compl | 2 Compl | Binary | Binary | D9 D10 | D7 D8 | D5 D6 | D3 D4 | D1 D2 | CLK D0 | 3V3 GND